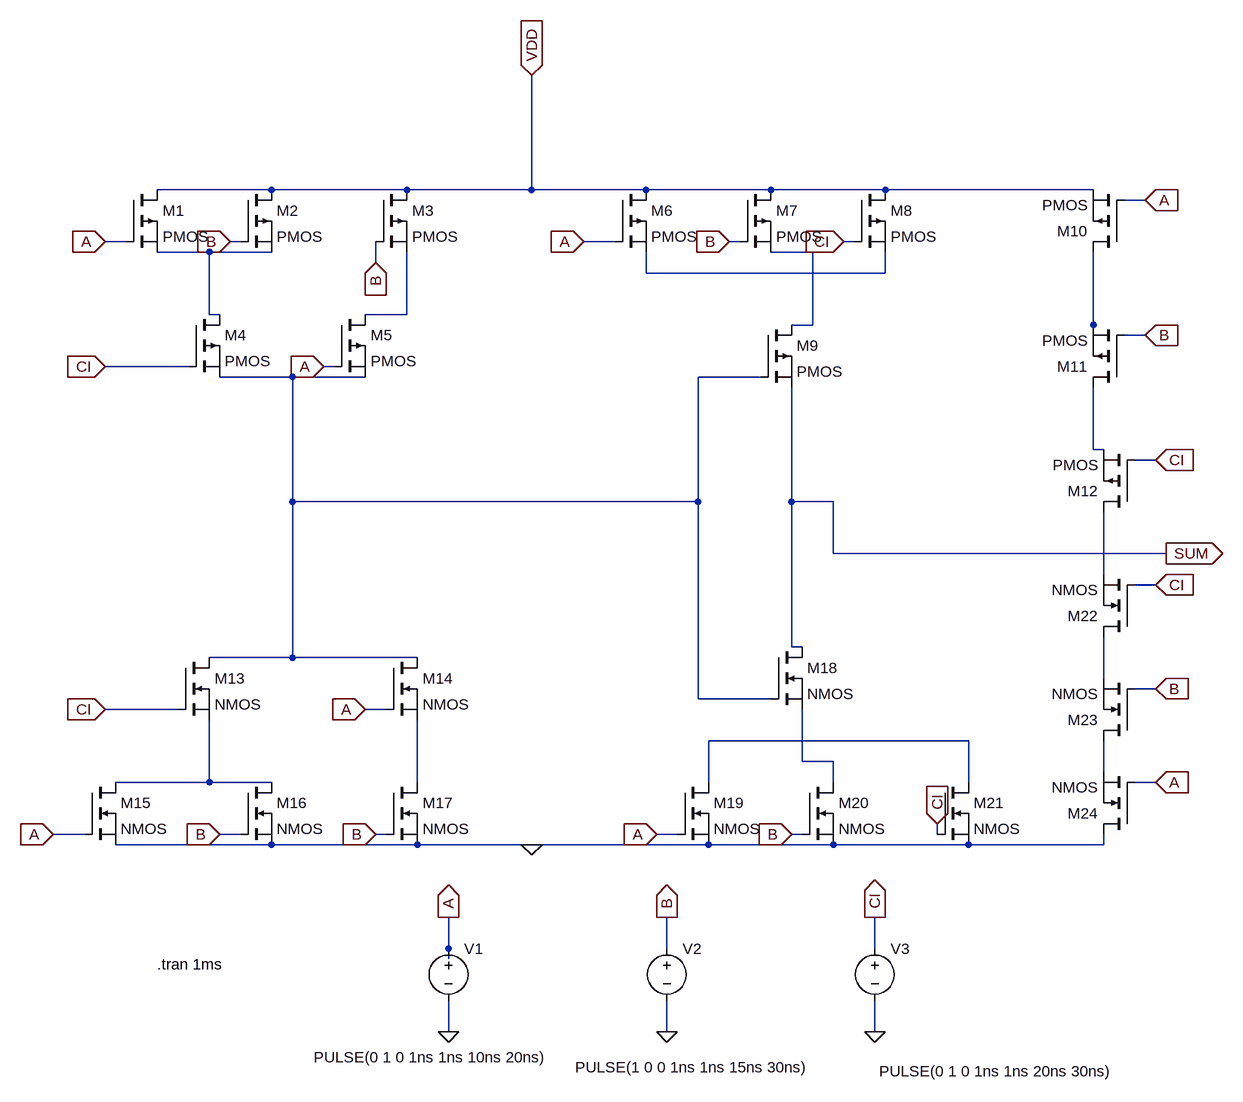
[diagram p0: schematic Draft5.asc]
Draft5.asc, the LTspice schematic file:
Version 4
SHEET 1 1820 1500
WIRE 352 128 176 128
WIRE 560 128 352 128
WIRE 752 128 752 -48
WIRE 752 128 560 128
WIRE 928 128 752 128
WIRE 1120 128 928 128
WIRE 1296 128 1120 128
WIRE 1616 128 1296 128
WIRE 1696 144 1664 144
WIRE 128 208 96 208
WIRE 304 208 288 208
WIRE 880 208 832 208
WIRE 1072 208 1056 208
WIRE 1248 208 1232 208
WIRE 256 224 176 224
WIRE 352 224 256 224
WIRE 1184 224 1120 224
WIRE 512 240 512 208
WIRE 928 256 928 224
WIRE 1296 256 1296 224
WIRE 1296 256 928 256
WIRE 256 320 256 224
WIRE 272 320 256 320
WIRE 560 320 560 224
WIRE 560 320 496 320
WIRE 1184 336 1184 224
WIRE 1184 336 1152 336
WIRE 1616 336 1616 224
WIRE 1616 352 1616 336
WIRE 1696 352 1664 352
WIRE 224 400 96 400
WIRE 448 400 432 400
WIRE 384 416 272 416
WIRE 496 416 384 416
WIRE 1104 416 1008 416
WIRE 1616 528 1616 432
WIRE 1632 528 1616 528
WIRE 1712 544 1680 544
WIRE 384 608 384 416
WIRE 1008 608 1008 416
WIRE 1008 608 384 608
WIRE 1152 608 1152 432
WIRE 1216 608 1152 608
WIRE 1216 688 1216 608
WIRE 1728 688 1216 688
WIRE 1632 720 1632 624
WIRE 1712 736 1680 736
WIRE 1152 832 1152 608
WIRE 1168 832 1152 832
WIRE 384 848 384 608
WIRE 384 848 256 848
WIRE 576 848 384 848
WIRE 1632 880 1632 816
WIRE 1712 896 1680 896
WIRE 1008 912 1008 608
WIRE 1120 912 1008 912
WIRE 208 928 96 928
WIRE 528 928 496 928
WIRE 1424 976 1024 976
WIRE 1168 1008 1168 928
WIRE 1216 1008 1168 1008
WIRE 1632 1024 1632 976
WIRE 256 1040 256 944
WIRE 256 1040 112 1040
WIRE 352 1040 256 1040
WIRE 576 1040 576 944
WIRE 1024 1040 1024 976
WIRE 1216 1040 1216 1008
WIRE 1424 1040 1424 976
WIRE 1712 1040 1680 1040
WIRE 64 1120 16 1120
WIRE 304 1120 272 1120
WIRE 528 1120 512 1120
WIRE 976 1120 944 1120
WIRE 1168 1120 1152 1120
WIRE 1376 1120 1376 1104
WIRE 352 1136 112 1136
WIRE 576 1136 352 1136
WIRE 752 1136 576 1136
WIRE 1024 1136 752 1136
WIRE 1216 1136 1024 1136
WIRE 1424 1136 1216 1136
WIRE 1632 1136 1632 1120
WIRE 1632 1136 1424 1136
WIRE 624 1296 624 1248
WIRE 960 1296 960 1248
WIRE 1280 1296 1280 1248
WIRE 624 1312 624 1296
WIRE 624 1424 624 1376
WIRE 960 1424 960 1376
WIRE 1280 1424 1280 1376
FLAG 752 -48 VDD
IOPIN 752 -48 In
FLAG 96 208 A
IOPIN 96 208 In
FLAG 96 400 CI
IOPIN 96 400 In
FLAG 288 208 B
IOPIN 288 208 In
FLAG 512 240 B
IOPIN 512 240 In
FLAG 432 400 A
IOPIN 432 400 In
FLAG 96 928 CI
IOPIN 96 928 In
FLAG 496 928 A
IOPIN 496 928 In
FLAG 16 1120 A
IOPIN 16 1120 In
FLAG 272 1120 B
IOPIN 272 1120 In
FLAG 512 1120 B
IOPIN 512 1120 In
FLAG 944 1120 A
IOPIN 944 1120 In
FLAG 1152 1120 B
IOPIN 1152 1120 In
FLAG 832 208 A
IOPIN 832 208 In
FLAG 1056 208 B
IOPIN 1056 208 In
FLAG 1232 208 CI
IOPIN 1232 208 In
FLAG 1696 144 A
IOPIN 1696 144 In
FLAG 1696 352 B
IOPIN 1696 352 In
FLAG 1712 544 CI
IOPIN 1712 544 In
FLAG 1712 736 CI
IOPIN 1712 736 In
FLAG 1712 896 B
IOPIN 1712 896 In
FLAG 1712 1040 A
IOPIN 1712 1040 In
FLAG 1376 1104 CI
IOPIN 1376 1104 In
FLAG 1728 688 SUM
IOPIN 1728 688 Out
FLAG 624 1248 A
IOPIN 624 1248 Out
FLAG 624 1424 0
FLAG 960 1424 0
FLAG 1280 1424 0
FLAG 752 1136 0
FLAG 960 1248 B
IOPIN 960 1248 Out
FLAG 1280 1248 CI
IOPIN 1280 1248 Out
SYMBOL pmos 128 128 R0
SYMATTR InstName M1
SYMBOL pmos 304 128 R0
SYMATTR InstName M2
SYMBOL pmos 512 128 R0
SYMATTR InstName M3
SYMBOL pmos 224 320 R0
SYMATTR InstName M4
SYMBOL pmos 448 320 R0
SYMATTR InstName M5
SYMBOL pmos 880 128 R0
SYMATTR InstName M6
SYMBOL pmos 1072 128 R0
SYMATTR InstName M7
SYMBOL pmos 1248 128 R0
SYMATTR InstName M8
SYMBOL pmos 1104 336 R0
SYMATTR InstName M9
SYMBOL pmos 1664 224 R180
SYMATTR InstName M10
SYMBOL pmos 1664 432 R180
SYMATTR InstName M11
SYMBOL pmos 1680 624 R180
SYMATTR InstName M12
SYMBOL nmos 208 848 R0
SYMATTR InstName M13
SYMBOL nmos 528 848 R0
SYMATTR InstName M14
SYMBOL nmos 64 1040 R0
SYMATTR InstName M15
SYMBOL nmos 304 1040 R0
SYMATTR InstName M16
SYMBOL nmos 528 1040 R0
SYMATTR InstName M17
SYMBOL nmos 1120 832 R0
SYMATTR InstName M18
SYMBOL nmos 976 1040 R0
SYMATTR InstName M19
SYMBOL nmos 1168 1040 R0
SYMATTR InstName M20
SYMBOL nmos 1376 1040 R0
SYMATTR InstName M21
SYMBOL nmos 1680 816 R180
SYMATTR InstName M22
SYMBOL nmos 1680 976 R180
SYMATTR InstName M23
SYMBOL nmos 1680 1120 R180
SYMATTR InstName M24
SYMBOL voltage 624 1280 R0
WINDOW 3 -207 183 Left 2
SYMATTR InstName V1
SYMATTR Value PULSE(0 1 0 1ns 1ns 10ns 20ns)
SYMBOL voltage 960 1280 R0
WINDOW 3 -141 199 Left 2
SYMATTR InstName V2
SYMATTR Value PULSE(1 0 0 1ns 1ns 15ns 30ns)
SYMBOL voltage 1280 1280 R0
WINDOW 3 7 205 Left 2
SYMATTR InstName V3
SYMATTR Value PULSE(0 1 0 1ns 1ns 20ns 30ns)
TEXT 176 1320 Left 2 !.tran 1ms

The netlist it stands for:
* Draft5.asc
M1 VDD A N001 N001 PMOS
M2 VDD B N001 N001 PMOS
M3 VDD B N004 N004 PMOS
M4 N001 CI N006 N006 PMOS
M5 N004 A N006 N006 PMOS
M6 VDD A N003 N003 PMOS
M7 VDD B N002 N002 PMOS
M8 VDD CI N003 N003 PMOS
M9 N002 N006 SUM SUM PMOS
M10 N005 A VDD VDD PMOS
M11 N007 B N005 N005 PMOS
M12 N008 CI N007 N007 PMOS
M13 N006 CI N013 N013 NMOS
M14 N006 A N014 N014 NMOS
M15 N013 A 0 0 NMOS
M16 N013 B 0 0 NMOS
M17 N014 B 0 0 NMOS
M18 SUM N006 N011 N011 NMOS
M19 N010 A 0 0 NMOS
M20 N011 B 0 0 NMOS
M21 N010 CI 0 0 NMOS
M22 N009 CI N008 N008 NMOS
M23 N012 B N009 N009 NMOS
M24 0 A N012 N012 NMOS
V1 A 0 PULSE(0 1 0 1ns 1ns 10ns 20ns)
V2 B 0 PULSE(1 0 0 1ns 1ns 15ns 30ns)
V3 CI 0 PULSE(0 1 0 1ns 1ns 20ns 30ns)
.model NMOS NMOS
.model PMOS PMOS
.lib standard.mos
.tran 1ms
.backanno
.end